# EAGLE design pcb (EAGLE 9.0.0)
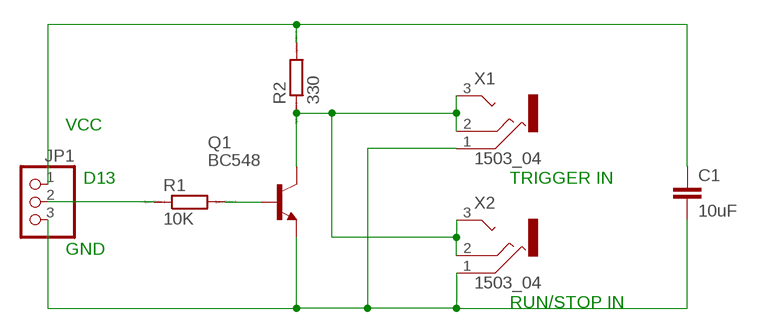
[diagram p0: schematic, sheet 1]

## Parts
C1  10uF  C-EU050-035X075  [C050-035X075]
JP1  PINHD-1X3  [1X03]
Q1  BC548  [TO92-EBC]
R1  10K  R0204/7  [0204/7]
R2  330  R0204/7  [0204/7]
X1  1503_04  [1503_04]
X2  1503_04  [1503_04]

## Nets
N$1: JP1.2 R1.1
N$2: Q1.B R1.2
N$4: C1.1 JP1.1 R2.2
N$5: C1.2 JP1.3 Q1.E X1.1 X2.1
N$6: Q1.C R2.1 X1.2 X1.3 X2.2 X2.3

## Notes on the sheet
- VCC
- D13 | TRIGGER IN
- GND
- RUN/STOP IN

## Library data of the parts
C1 = rcl:C-EU: CAPACITOR, European symbol; SPICEPREFIX: C
JP1 = pinhead:PINHD-1X3: PIN HEADER
Q1 = transistor-npn:BC548*: NPN Transistor
R1 R2 = eagle-ltspice:R: RESISTOR, European symbol; SPICEMODEL: NONE; SPICEPREFIX: R
X1 X2 = con-lumberg:1503_04: Jack connectors according to JISC 6560, 3.5 mm, IP 57 Klinkensteckverbinder nach JISC 6560, 3,5 mm, IP 57 Source: http://www.lumberg.com/Produkte/PDFs/1503_04.pdf; OC_FARNELL: 1216981; OC_NEWARK: unknown

## Board
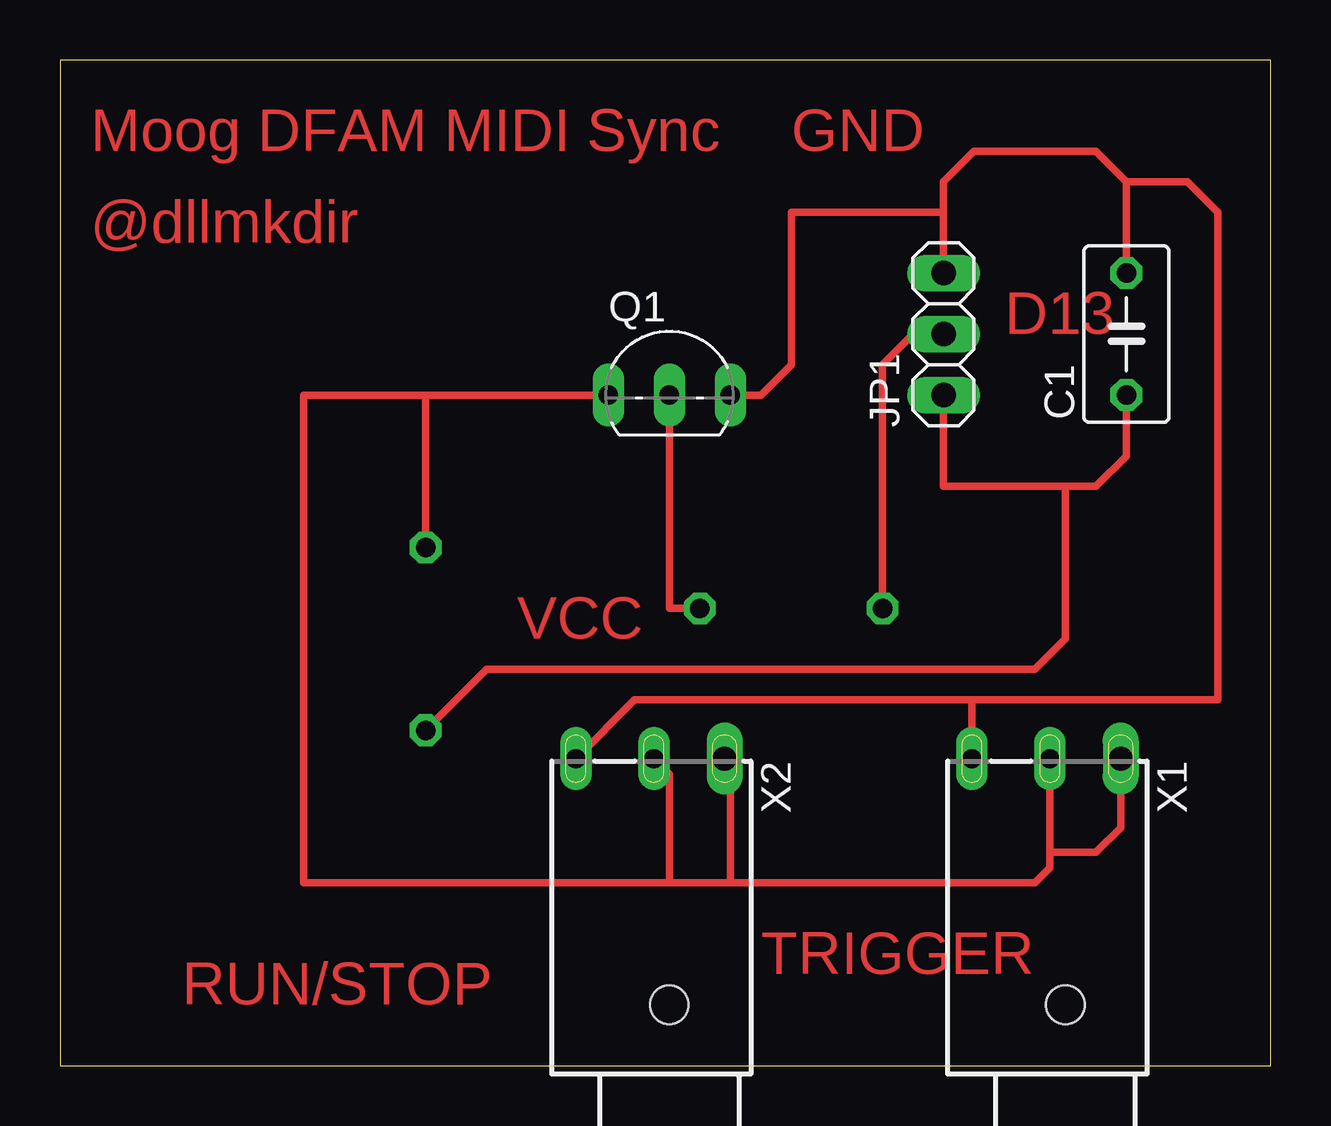
[diagram p1: board, top side]
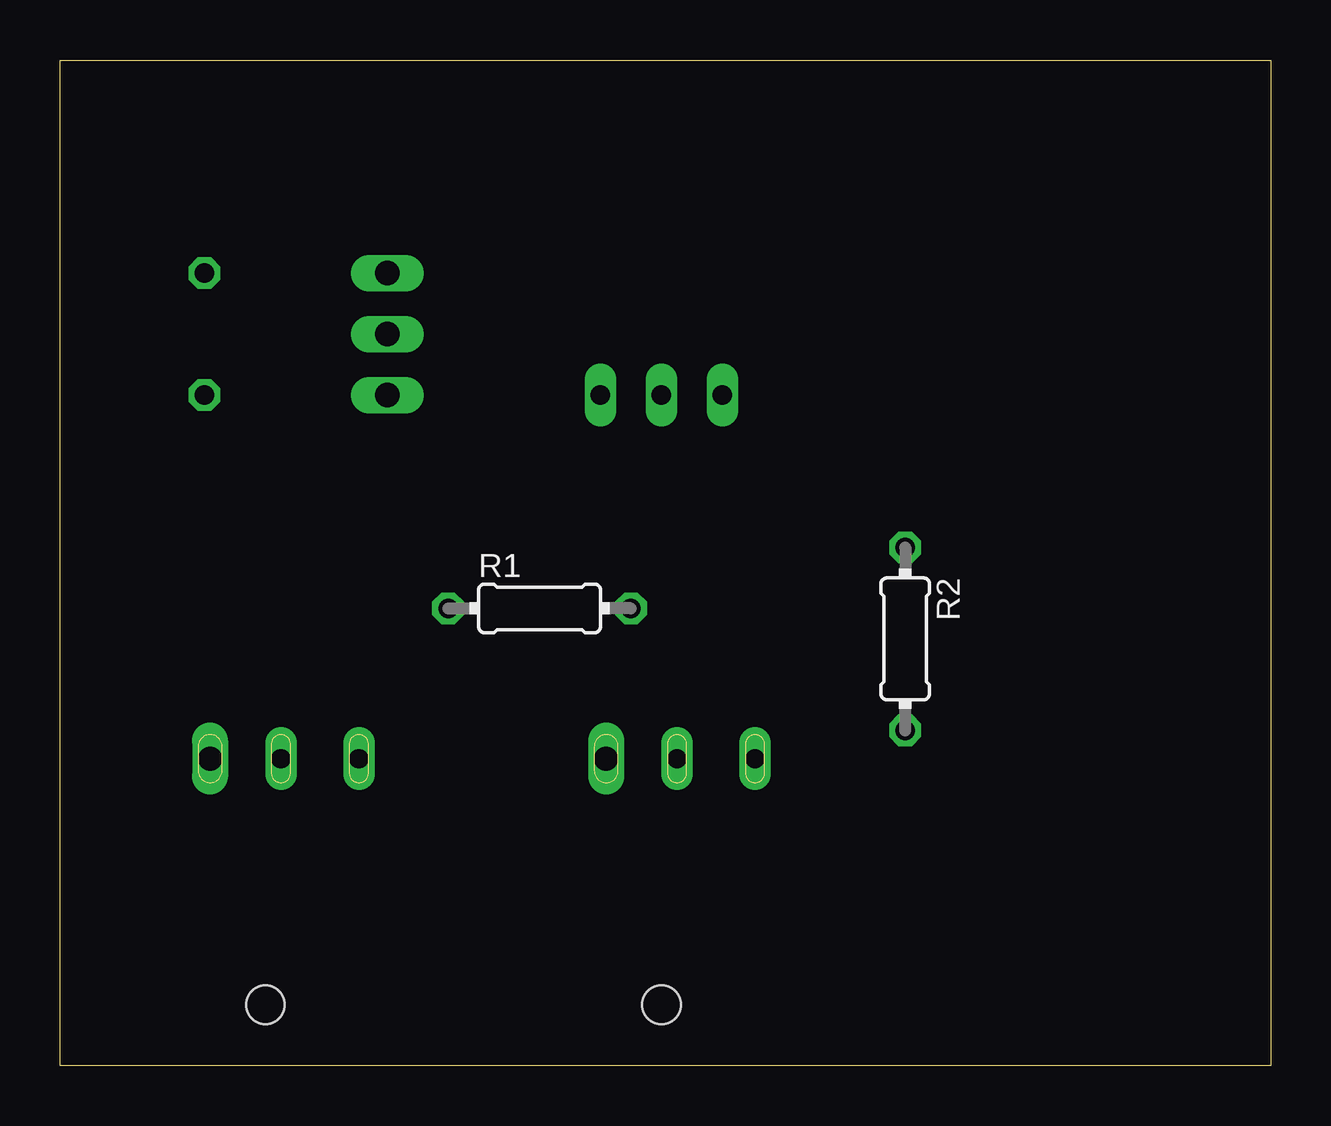
[diagram p2: board, bottom side, seen from below]

Size 50.47 x 41.9 mm. Coordinates in mm from the lower left corner, seen from the top.
Outline: 0,0 50.47,0 50.47,41.9 0,41.9 0,0
Copper layers (1*16): Top 0.035mm / dielectric 1.5mm / Bottom 0.035mm
Design rules "default": minimum track width 6mil, minimum drill 0.35mm, track to track 6mil, track to pad 6mil, pad to pad 6mil, via to via 6mil, smd to smd 6mil, copper to edge 40mil, drill to drill 6mil, minimum pad ring 10mil, minimum via ring 8mil, stop-mask expansion 4mil, vias tented up to drill 0mil, thermal gap 10mil

### Footprints (pad centres in the part's own frame; a part is rotated, then mirrored left to right if it is on the bottom)
C050-035X075 = drill 0.813 octagon: 1 -2.54,0; 2 2.54,0
1X03 = drill 1.016 long: 1 -2.54,0; 2 0,0; 3 2.54,0
TO92-EBC = drill 0.813 long: B 0,-1.27; C -2.54,-1.27; E 2.54,-1.27
0204/7 = drill 0.813 octagon: 1 -3.81,0; 2 3.81,0
1503_04 = drill 0.8 pad 1.2 long: 1 3.9,-10.25; 2 0.65,-10.25 | drill 1 pad 1.2 long: 3 -2.3,-10.25 | hole 1.6: 0,0

### Placement (x,y rotation side)
C1  44.45,30.48 90 top
JP1  36.83,30.48 90 top
Q1  25.4,29.21 0 top
R1  30.48,19.05 0 bottom
R2  15.24,17.78 270 bottom
X1  41.91,2.54 180 top
X2  25.4,2.54 180 top

### Tracks (layer width: path | path; a pad name or v marks a point on that pad's centre or on a via)
N$1
  Top 0.305: R1.1 34.29,29.21 35.56,30.48 JP1.2
N$2
  Top 0.305: R1.2 25.4,19.05 Q1.B
N$4
  Top 0.305: C1.1 44.45,25.4 43.18,24.13 41.91,24.13 | 41.91,24.13 36.83,24.13 JP1.1 | R2.2 17.78,16.51 40.64,16.51 41.91,17.78 41.91,24.13
N$5
  Top 0.305: JP1.3 36.83,35.56 | 36.83,35.56 36.83,36.83 38.1,38.1 43.18,38.1 44.45,36.83 | 44.45,36.83 C1.2 | Q1.E 29.21,27.94 30.48,29.21 30.48,35.56 36.83,35.56 | X2.1 23.95,15.24 38.1,15.24 | 38.1,15.24 48.26,15.24 48.26,35.56 46.99,36.83 44.45,36.83 | X1.1 38.01,15.15 38.1,15.24
N$6
  Top 0.305: X1.2 41.26,8.89 | 41.26,8.89 41.26,8.24 40.64,7.62 27.94,7.62 | 27.94,7.62 25.4,7.62 | 25.4,7.62 10.16,7.62 10.16,27.94 15.24,27.94 | 15.24,27.94 Q1.C | X1.3 44.21,9.92 43.18,8.89 41.26,8.89 | X2.3 27.94,12.55 27.94,7.62 | X2.2 25.4,12.14 25.4,7.62 | R2.1 15.24,27.94

### Text on the board
Top: Moog DFAM MIDI Sync | GND | @dllmkdir | D13 | VCC | TRIGGER | RUN/STOP